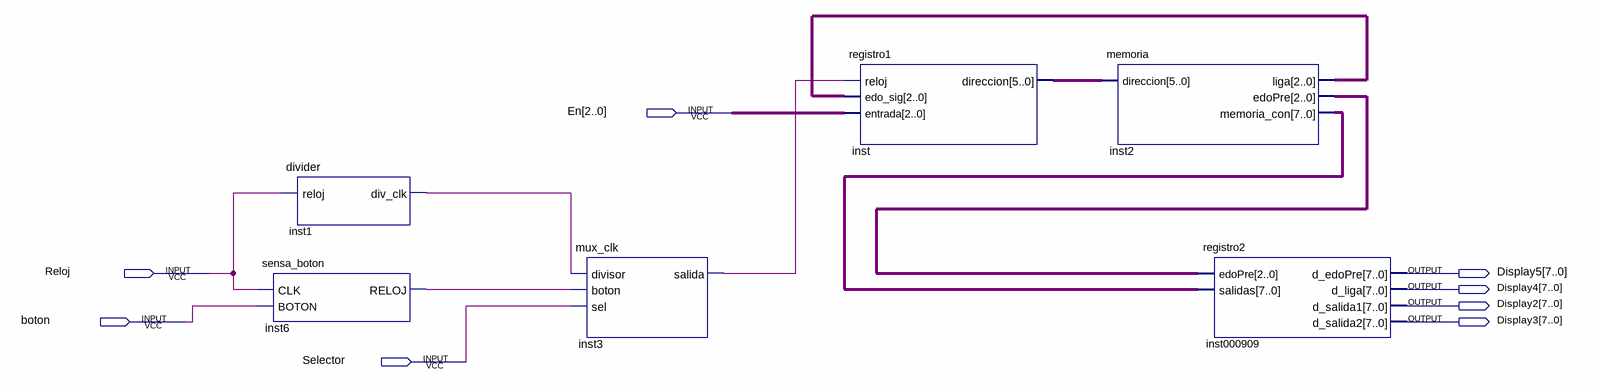
[diagram p0: schematic sheet]
// Quartus schematic practica3.bdf as structural Verilog: 6 symbols, 8 pins
module practica3 (
  input  [2:0] En,
  input  Reloj,
  input  boton,
  input  Selector,
  output [7:0] Display5,
  output [7:0] Display4,
  output [7:0] Display2,
  output [7:0] Display3
);

  wire inst1_div_clk, inst3_salida, inst6_reloj;
  wire [2:0] inst2_edopre, inst2_liga;
  wire [5:0] inst_direccion;
  wire [7:0] inst2_memoria_con;

  divider inst1 (.reloj(Reloj), .div_clk(inst1_div_clk));
  sensa_boton inst6 (.CLK(Reloj), .BOTON(boton), .RELOJ(inst6_reloj));
  mux_clk inst3 (.divisor(inst1_div_clk), .boton(inst6_reloj), .sel(Selector), .salida(inst3_salida));
  registro1 inst (.reloj(inst3_salida), .edo_sig(inst2_liga), .entrada(En), .direccion(inst_direccion));
  memoria inst2 (.direccion(inst_direccion), .liga(inst2_liga), .edoPre(inst2_edopre), .memoria_con(inst2_memoria_con));
  registro2 inst000909 (
    .edoPre(inst2_edopre), .salidas(inst2_memoria_con), .d_edoPre(Display5), .d_liga(Display4),
    .d_salida1(Display2), .d_salida2(Display3));
endmodule
